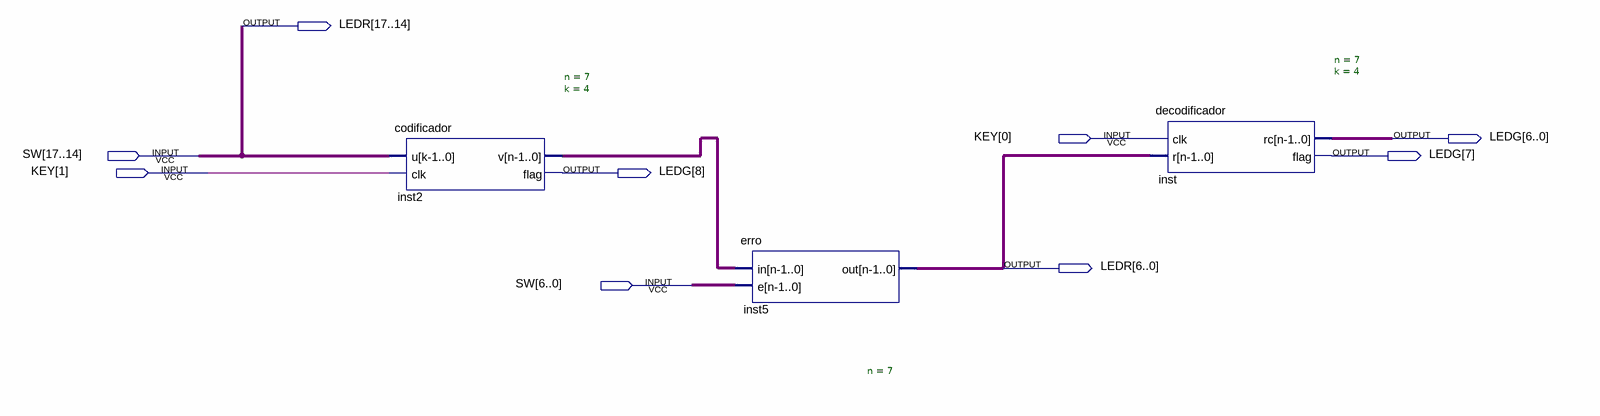
[diagram p0: schematic sheet]
// Quartus schematic teste.bdf as structural Verilog: 3 symbols, 9 pins
module teste (
  input  [1:0] KEY,
  input  [17:0] SW,
  output [17:0] LEDR,
  output [8:0] LEDG
);

  wire [6:0] inst2_v;

  codificador #(.n(7), .k(4)) inst2 (.u(SW[17:14]), .clk(KEY[1]), .v(inst2_v), .flag(LEDG[8]));
  erro #(.n(7)) inst5 (.in(inst2_v), .e(SW[6:0]), .out(LEDR[6:0]));
  decodificador #(.n(7), .k(4)) inst (.clk(KEY[0]), .r(LEDR[6:0]), .rc(LEDG[6:0]), .flag(LEDG[7]));

  assign LEDR[17:14] = SW[17:14];
endmodule
